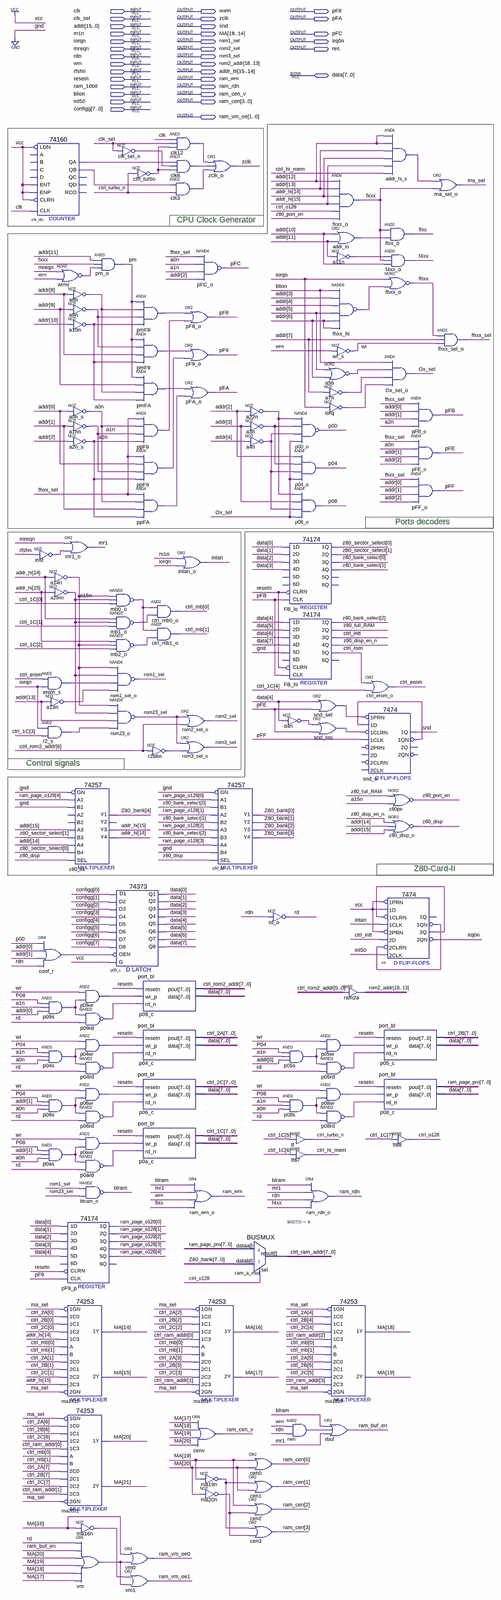
[diagram p0: schematic sheet, whole]
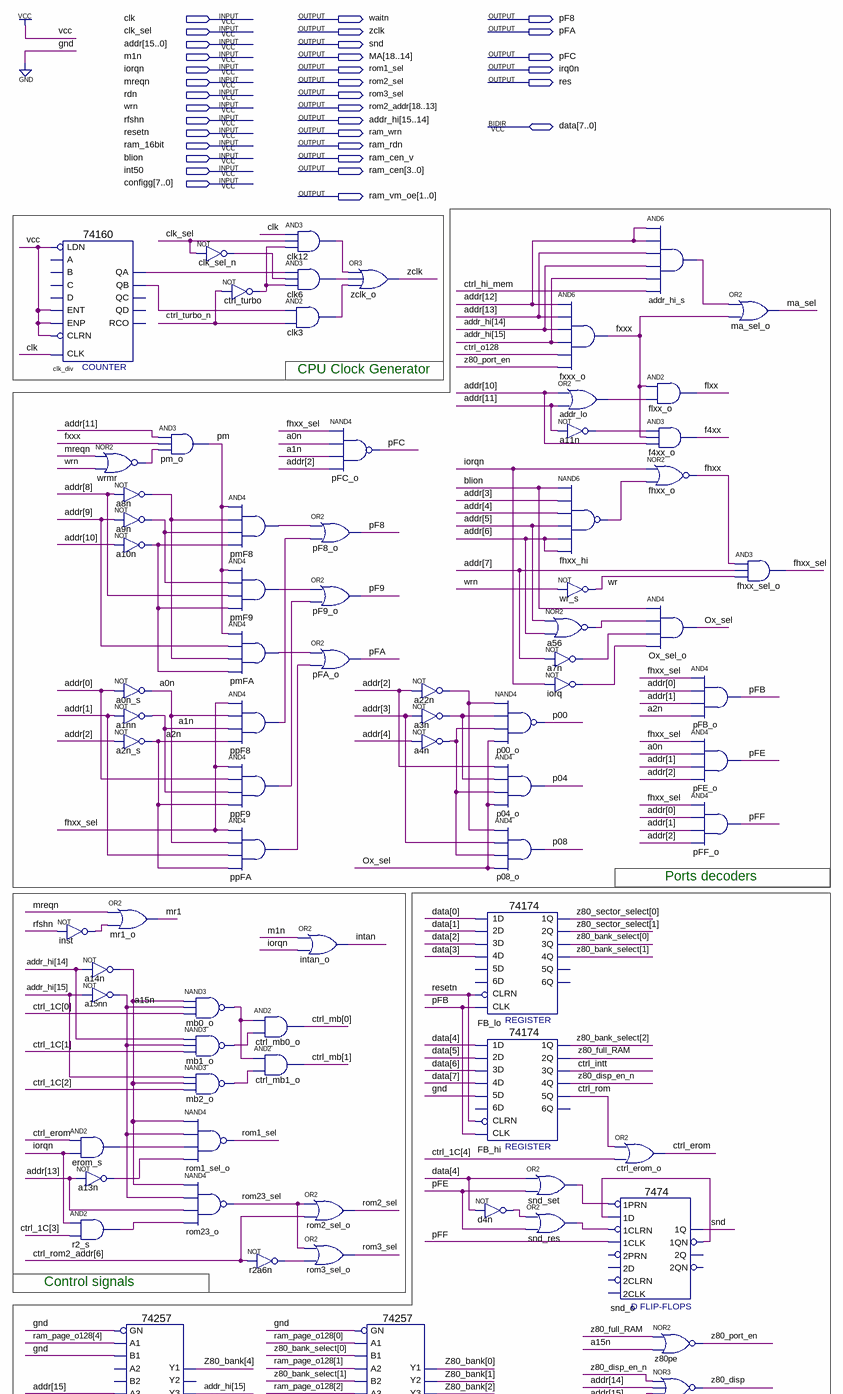
[diagram p1: schematic sheet, upper part]
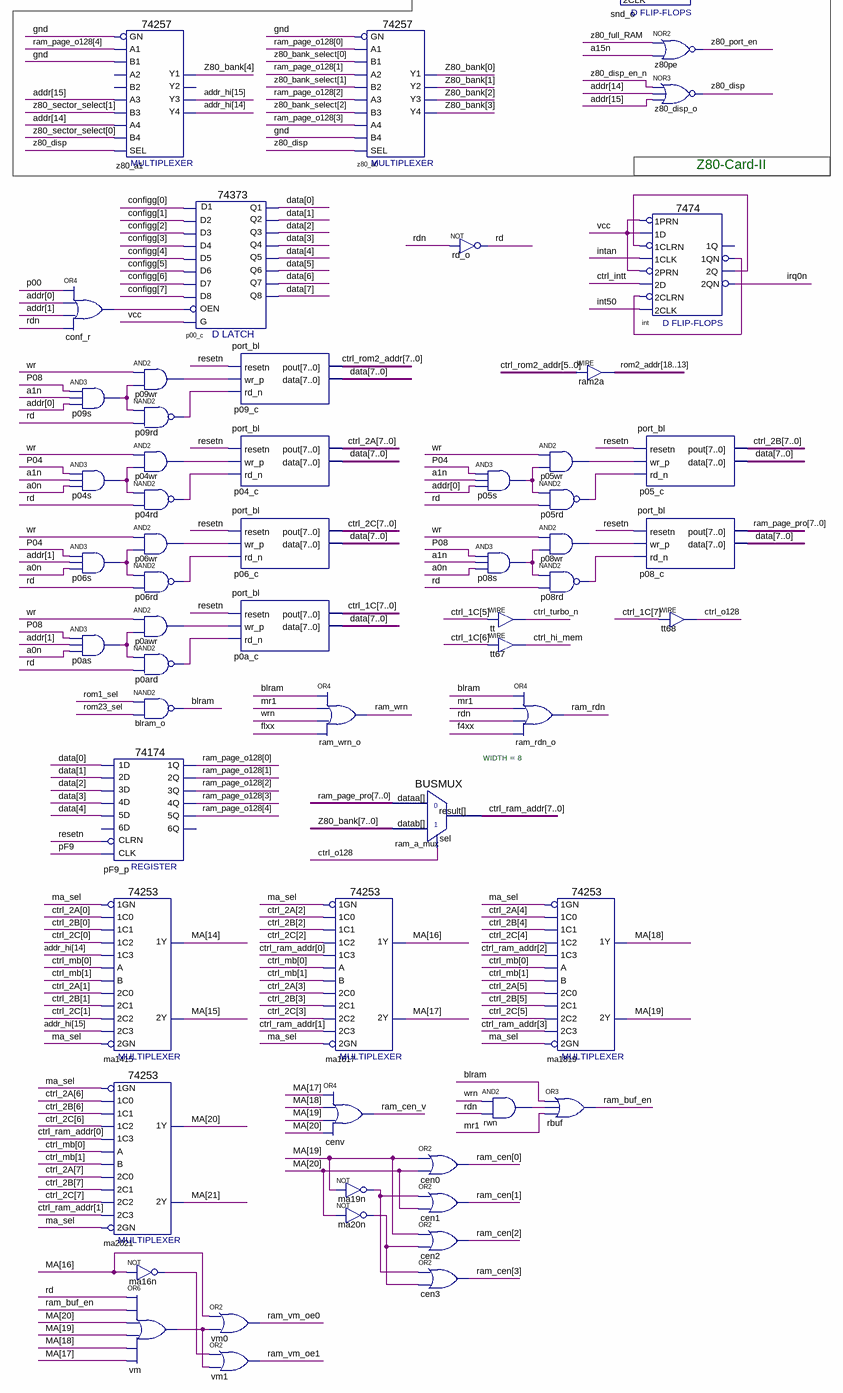
[diagram p2: schematic sheet, lower part]
// Quartus schematic cpu_ports_sch.bdf as structural Verilog: 132 symbols, 34 pins
module cpu_ports_sch (
  input  clk,
  input  clk_sel,
  input  [15:0] addr,
  input  m1n,
  input  iorqn,
  input  mreqn,
  input  rdn,
  input  wrn,
  input  rfshn,
  input  resetn,
  input  ram_16bit,
  input  blion,
  input  int50,
  input  [7:0] configg,
  inout  [7:0] data,
  output waitn,
  output pF8,
  output zclk,
  output pFA,
  output snd,
  output [21:14] MA,
  output pFC,
  output rom1_sel,
  output irq0n,
  output rom2_sel,
  output res,
  output rom3_sel,
  output [18:13] rom2_addr,
  output [15:14] addr_hi,
  output ram_wrn,
  output ram_rdn,
  output ram_cen_v,
  output [3:0] ram_cen,
  output [1:0] ram_vm_oe
);

  wire a0n, a1n, a2n, a3n_out, a4n_out, a7n_out, a8n_out, a9n_out, a10n_out, a11n_out, a13n_out, a14n_out,
       a15n, a22n_out, a56_out, addr_hi_s_out, addr_lo_out, blram, clk3_out, clk6_out, clk12_out, clk_div_qa,
       clk_div_qb, clk_sel_n_out, conf_r_out, ctrl_erom, ctrl_hi_mem, ctrl_intt, ctrl_o128, ctrl_rom,
       ctrl_turbo_n, ctrl_turbo_out, d4n_out, erom_s_out, f4xx, fhxx, fhxx_hi_out, fhxx_sel, flxx, fxxx,
       inst_out, int_1qn, int_2q, intan, iorq_out, ma16n_out, ma19n_out, ma20n_out, ma_sel, mb0_o_out,
       mb1_o_out, mb2_o_out, mr1, Ox_sel, p00, p0ard_out, p0as_out, p0awr_out, p04, p04rd_out, p04s_out,
       p04wr_out, p05rd_out, p05s_out, p05wr_out, p06rd_out, p06s_out, p06wr_out, p08, p08rd_out, p08s_out,
       p08wr_out, p09rd_out, p09s_out, p09wr_out, pF9, pFB, pFE, pFF, pm, pmF8_out, pmF9_out, pmFA_out,
       ppF8_out, ppF9_out, ppFA_out, r2_s_out, r2a6n_out, ram_buf_en, rd, rom23_sel, rwn_out, snd_o_1qn,
       snd_res_out, snd_set_out, vm_out, wr, wrmr_out, z80_disp, z80_disp_en_n, z80_full_RAM, z80_port_en;
  wire [1:0] ctrl_mb, z80_sector_select;
  wire [2:0] z80_bank_select;
  wire [4:0] ram_page_o128;
  wire [7:0] ctrl_1C, ctrl_2A, ctrl_2B, ctrl_2C, ctrl_ram_addr, ctrl_rom2_addr, ram_page_pro, Z80_bank;

  \74160  clk_div (
    .CLK(clk), .ENT(1'b1), .LDN(1'b1), .ENP(1'b1), .CLRN(1'b1), .QA(clk_div_qa), .QB(clk_div_qb));  // open: A, B, C, D, QD, QC, RCO
  not inst (inst_out, rfshn);
  and erom_s (erom_s_out, ctrl_erom, iorqn);
  not a13n (a13n_out, addr[13]);
  and r2_s (r2_s_out, iorqn, ctrl_1C[3]);
  or conf_r (conf_r_out, p00, addr[0], addr[1], rdn);
  and p09s (p09s_out, p08, a1n, addr[0]);
  and p04s (p04s_out, p04, a1n, a0n);
  and p06s (p06s_out, p04, addr[1], a0n);
  and p0as (p0as_out, p08, addr[1], a0n);
  nor wrmr (wrmr_out, mreqn, wrn);
  not a8n (a8n_out, addr[8]);
  not a9n (a9n_out, addr[9]);
  not a10n (a10n_out, addr[10]);
  not a0n_s (a0n, addr[0]);
  not a1nn (a1n, addr[1]);
  not a2n_s (a2n, addr[2]);
  or mr1_o (mr1, mreqn, inst_out);
  not a14n (a14n_out, addr_hi[14]);
  not a15nn (a15n, addr_hi[15]);
  \74257  z80_a1 (
    .B1(1'b0), .A1(ram_page_o128[4]), .B3(z80_sector_select[1]), .A3(addr[15]), .A4(addr[14]),
    .B4(z80_sector_select[0]), .SEL(z80_disp), .GN(1'b0), .Y3(addr_hi[15]), .Y4(addr_hi[14]), .Y1(Z80_bank[4]));  // open: A2, B2, Y2
  \74174  pF9_p (
    .\4D (data[3]), .\3D (data[2]), .\5D (data[4]), .CLK(pF9), .CLRN(resetn), .\1D (data[0]), .\2D (data[1]),
    .\1Q (ram_page_o128[0]), .\4Q (ram_page_o128[3]), .\3Q (ram_page_o128[2]), .\2Q (ram_page_o128[1]),
    .\5Q (ram_page_o128[4]));  // open: 6D, 6Q
  \74253  ma1415 (
    .\1GN (ma_sel), .\1C3 (addr_hi[14]), .\1C2 (ctrl_2C[0]), .\2C2 (ctrl_2C[1]), .\2C3 (addr_hi[15]),
    .\1C1 (ctrl_2B[0]), .\1C0 (ctrl_2A[0]), .\2C1 (ctrl_2B[1]), .\2C0 (ctrl_2A[1]), .B(ctrl_mb[1]),
    .A(ctrl_mb[0]), .\2GN (ma_sel), .\2Y (MA[15]), .\1Y (MA[14]));
  \74253  ma2021 (
    .\1GN (ma_sel), .\1C3 (ctrl_ram_addr[0]), .\1C2 (ctrl_2C[6]), .\2C2 (ctrl_2C[7]),
    .\2C3 (ctrl_ram_addr[1]), .\1C1 (ctrl_2B[6]), .\1C0 (ctrl_2A[6]), .\2C1 (ctrl_2B[7]), .\2C0 (ctrl_2A[7]),
    .B(ctrl_mb[1]), .A(ctrl_mb[0]), .\2GN (ma_sel), .\2Y (MA[21]), .\1Y (MA[20]));
  not ma16n (ma16n_out, MA[16]);
  or vm (vm_out, rd, ram_buf_en, MA[20], MA[19], MA[18], MA[17]);
  and pm_o (pm, addr[11], fxxx, wrmr_out);
  and p09wr (p09wr_out, wr, p09s_out);
  nand p09rd (p09rd_out, p09s_out, rd);
  and p04wr (p04wr_out, wr, p04s_out);
  nand p04rd (p04rd_out, p04s_out, rd);
  and p06wr (p06wr_out, wr, p06s_out);
  nand p06rd (p06rd_out, p06s_out, rd);
  and p0awr (p0awr_out, wr, p0as_out);
  nand p0ard (p0ard_out, p0as_out, rd);
  nand blram_o (blram, rom1_sel, rom23_sel);
  not clk_sel_n (clk_sel_n_out, clk_sel);
  not ctrl_turbo (ctrl_turbo_out, ctrl_turbo_n);
  and pmF8 (pmF8_out, pm, a8n_out, a9n_out, a10n_out);
  and pmF9 (pmF9_out, pm, a9n_out, addr[8], a10n_out);
  and pmFA (pmFA_out, pm, addr[9], a8n_out, a10n_out);
  and ppF8 (ppF8_out, fhxx_sel, a0n, a1n, a2n);
  and ppF9 (ppF9_out, fhxx_sel, addr[0], a1n, a2n);
  and ppFA (ppFA_out, fhxx_sel, a0n, addr[1], a2n);
  nand mb0_o (mb0_o_out, a14n_out, a15n, ctrl_1C[0]);
  nand mb1_o (mb1_o_out, addr_hi[14], a15n, ctrl_1C[1]);
  nand mb2_o (mb2_o_out, addr_hi[15], a14n_out, ctrl_1C[2]);
  nand rom1_sel_o (rom1_sel, a14n_out, a15n, erom_s_out, a13n_out);
  nand rom23_o (rom23_sel, a14n_out, a15n, addr[13], r2_s_out);
  \74373  p00_c (
    .D1(configg[0]), .D3(configg[2]), .D6(configg[5]), .D7(configg[6]), .D2(configg[1]), .G(1'b1),
    .D4(configg[3]), .D5(configg[4]), .D8(configg[7]), .OEN(conf_r_out), .Q3(data[2]), .Q6(data[5]),
    .Q7(data[6]), .Q2(data[1]), .Q8(data[7]), .Q4(data[3]), .Q5(data[4]), .Q1(data[0]));
  port_bl p09_c (.resetn(resetn), .wr_p(p09wr_out), .rd_n(p09rd_out), .pout(ctrl_rom2_addr), .data(data));
  port_bl p04_c (.resetn(resetn), .wr_p(p04wr_out), .rd_n(p04rd_out), .pout(ctrl_2A), .data(data));
  port_bl p06_c (.resetn(resetn), .wr_p(p06wr_out), .rd_n(p06rd_out), .pout(ctrl_2C), .data(data));
  port_bl p0a_c (.resetn(resetn), .wr_p(p0awr_out), .rd_n(p0ard_out), .pout(ctrl_1C), .data(data));
  or vm0 (ram_vm_oe[0], MA[16], vm_out);
  or vm1 (ram_vm_oe[1], ma16n_out, vm_out);
  and ctrl_mb0_o (ctrl_mb[0], mb0_o_out, mb1_o_out);
  and ctrl_mb1_o (ctrl_mb[1], mb0_o_out, mb2_o_out);
  not r2a6n (r2a6n_out, ctrl_rom2_addr[6]);
  and clk12 (clk12_out, clk, clk_sel, ctrl_turbo_out);
  and clk6 (clk6_out, clk_div_qa, clk_sel_n_out, ctrl_turbo_out);
  and clk3 (clk3_out, clk_div_qb, ctrl_turbo_n);
  nand pFC_o (pFC, fhxx_sel, a0n, a1n, addr[2]);
  or pF8_o (pF8, pmF8_out, ppF8_out);
  or pF9_o (pF9, pmF9_out, ppF9_out);
  or pFA_o (pFA, pmFA_out, ppFA_out);
  or intan_o (intan, m1n, iorqn);
  or rom2_sel_o (rom2_sel, rom23_sel, ctrl_rom2_addr[6]);
  or rom3_sel_o (rom3_sel, rom23_sel, r2a6n_out);
  or ram_wrn_o (ram_wrn, blram, mr1, wrn, flxx);
  \74253  ma1617 (
    .\1GN (ma_sel), .\1C3 (ctrl_ram_addr[0]), .\1C2 (ctrl_2C[2]), .\2C2 (ctrl_2C[3]),
    .\2C3 (ctrl_ram_addr[1]), .\1C1 (ctrl_2B[2]), .\1C0 (ctrl_2A[2]), .\2C1 (ctrl_2B[3]), .\2C0 (ctrl_2A[3]),
    .B(ctrl_mb[1]), .A(ctrl_mb[0]), .\2GN (ma_sel), .\2Y (MA[17]), .\1Y (MA[16]));
  or cenv (ram_cen_v, MA[17], MA[18], MA[19], MA[20]);
  or zclk_o (zclk, clk12_out, clk6_out, clk3_out);
  \74257  z80_a0 (
    .B1(z80_bank_select[0]), .A1(ram_page_o128[0]), .B3(z80_bank_select[2]), .A2(ram_page_o128[1]),
    .B2(z80_bank_select[1]), .A3(ram_page_o128[2]), .A4(ram_page_o128[3]), .B4(1'b0), .SEL(z80_disp),
    .GN(1'b0), .Y2(Z80_bank[1]), .Y3(Z80_bank[2]), .Y4(Z80_bank[3]), .Y1(Z80_bank[0]));
  not ma19n (ma19n_out, MA[19]);
  not ma20n (ma20n_out, MA[20]);
  not a22n (a22n_out, addr[2]);
  not a3n (a3n_out, addr[3]);
  not a4n (a4n_out, addr[4]);
  BUSMUX #(.WIDTH(8)) ram_a_mux (.datab(Z80_bank), .sel(ctrl_o128), .dataa(ram_page_pro), .result(ctrl_ram_addr));
  or cen0 (ram_cen[0], MA[19], MA[20]);
  or cen1 (ram_cen[1], ma19n_out, MA[20]);
  or cen2 (ram_cen[2], MA[19], ma20n_out);
  or cen3 (ram_cen[3], ma19n_out, ma20n_out);
  \74174  FB_lo (
    .\4D (data[3]), .\3D (data[2]), .CLK(pFB), .CLRN(resetn), .\1D (data[0]), .\2D (data[1]),
    .\1Q (z80_sector_select[0]), .\4Q (z80_bank_select[1]), .\3Q (z80_bank_select[0]),
    .\2Q (z80_sector_select[1]));  // open: 5D, 6D, 6Q, 5Q
  \74174  FB_hi (
    .\4D (data[7]), .\3D (data[6]), .\5D (1'b0), .CLK(pFB), .CLRN(resetn), .\1D (data[4]), .\2D (data[5]),
    .\1Q (z80_bank_select[2]), .\4Q (z80_disp_en_n), .\3Q (ctrl_intt), .\2Q (z80_full_RAM), .\5Q (ctrl_rom));  // open: 6D, 6Q
  not d4n (d4n_out, data[4]);
  not rd_o (rd, rdn);
  and p05s (p05s_out, p04, a1n, addr[0]);
  and p08s (p08s_out, p08, a1n, a0n);
  and rwn (rwn_out, wrn, rdn);
  nand p00_o (p00, a22n_out, a3n_out, a4n_out, Ox_sel);
  and p04_o (p04, addr[2], a3n_out, a4n_out, Ox_sel);
  and p08_o (p08, a22n_out, addr[3], a4n_out, Ox_sel);
  or snd_set (snd_set_out, data[4], pFE);
  or snd_res (snd_res_out, d4n_out, pFE);
  assign ctrl_turbo_n = ctrl_1C[5];  // WIRE tt
  assign ctrl_hi_mem = ctrl_1C[6];  // WIRE tt67
  or ram_rdn_o (ram_rdn, blram, mr1, rdn, f4xx);
  and fxxx_o (fxxx, addr[12], addr[13], addr_hi[14], addr_hi[15], ctrl_o128, z80_port_en);
  or addr_lo (addr_lo_out, addr[10], addr[11]);
  not a11n (a11n_out, addr[11]);
  nand fhxx_hi (fhxx_hi_out, blion, addr[3], addr[4], addr[5], addr[6], addr[6]);
  not wr_s (wr, wrn);
  nor a56 (a56_out, addr[5], addr[6]);
  not a7n (a7n_out, addr[7]);
  not iorq (iorq_out, iorqn);
  assign rom2_addr = ctrl_rom2_addr[5:0];  // WIRE ram2a
  and p05wr (p05wr_out, wr, p05s_out);
  nand p05rd (p05rd_out, p05s_out, rd);
  and p08wr (p08wr_out, wr, p08s_out);
  nand p08rd (p08rd_out, p08s_out, rd);
  \74253  ma1819 (
    .\1GN (ma_sel), .\1C3 (ctrl_ram_addr[2]), .\1C2 (ctrl_2C[4]), .\2C2 (ctrl_2C[5]),
    .\2C3 (ctrl_ram_addr[3]), .\1C1 (ctrl_2B[4]), .\1C0 (ctrl_2A[4]), .\2C1 (ctrl_2B[5]), .\2C0 (ctrl_2A[5]),
    .B(ctrl_mb[1]), .A(ctrl_mb[0]), .\2GN (ma_sel), .\2Y (MA[19]), .\1Y (MA[18]));
  or rbuf (ram_buf_en, blram, rwn_out, mr1);
  or ctrl_erom_o (ctrl_erom, ctrl_rom, ctrl_1C[4]);
  \7474  snd_o (
    .\1CLK (pFF), .\1D (snd_o_1qn), .\1PRN (snd_set_out), .\1CLRN (snd_res_out), .\1QN (snd_o_1qn), .\1Q (snd));  // open: 2D, 2PRN, 2CLK, 2CLRN, 2Q, 2QN
  port_bl p05_c (.resetn(resetn), .wr_p(p05wr_out), .rd_n(p05rd_out), .pout(ctrl_2B), .data(data));
  port_bl p08_c (.resetn(resetn), .wr_p(p08wr_out), .rd_n(p08rd_out), .pout(ram_page_pro), .data(data));
  and addr_hi_s (addr_hi_s_out, addr[12], addr[12], addr[13], addr_hi[14], addr_hi[15], ctrl_hi_mem);
  and flxx_o (flxx, fxxx, addr_lo_out);
  and f4xx_o (f4xx, a11n_out, fxxx, addr[10]);
  nor fhxx_o (fhxx, iorqn, fhxx_hi_out);
  and Ox_sel_o (Ox_sel, blion, a56_out, a7n_out, iorq_out);
  nor z80pe (z80_port_en, z80_full_RAM, a15n);
  nor z80_disp_o (z80_disp, z80_disp_en_n, addr[14], addr[15]);
  \7474  \int  (
    .\2D (ctrl_intt), .\2PRN (1'b1), .\1CLK (intan), .\1D (1'b1), .\1PRN (1'b1), .\2CLK (int50),
    .\2CLRN (int_1qn), .\1CLRN (int_2q), .\1QN (int_1qn), .\2Q (int_2q), .\2QN (irq0n));  // open: 1Q
  assign ctrl_o128 = ctrl_1C[7];  // WIRE tt68
  or ma_sel_o (ma_sel, addr_hi_s_out, fxxx);
  and fhxx_sel_o (fhxx_sel, fhxx, addr[7], wr);
  and pFB_o (pFB, fhxx_sel, addr[0], addr[1], a2n);
  and pFE_o (pFE, fhxx_sel, a0n, addr[1], addr[2]);
  and pFF_o (pFF, fhxx_sel, addr[0], addr[1], addr[2]);

  // Notes on the sheet:
  //   CPU Clock Generator
  //   Ports decoders
  //   Control signals
  //   Z80-Card-II
endmodule
